# Altium schematic sheet Isolated-Inputs-Schematic.SchDoc
size A; SheetNumber: 3
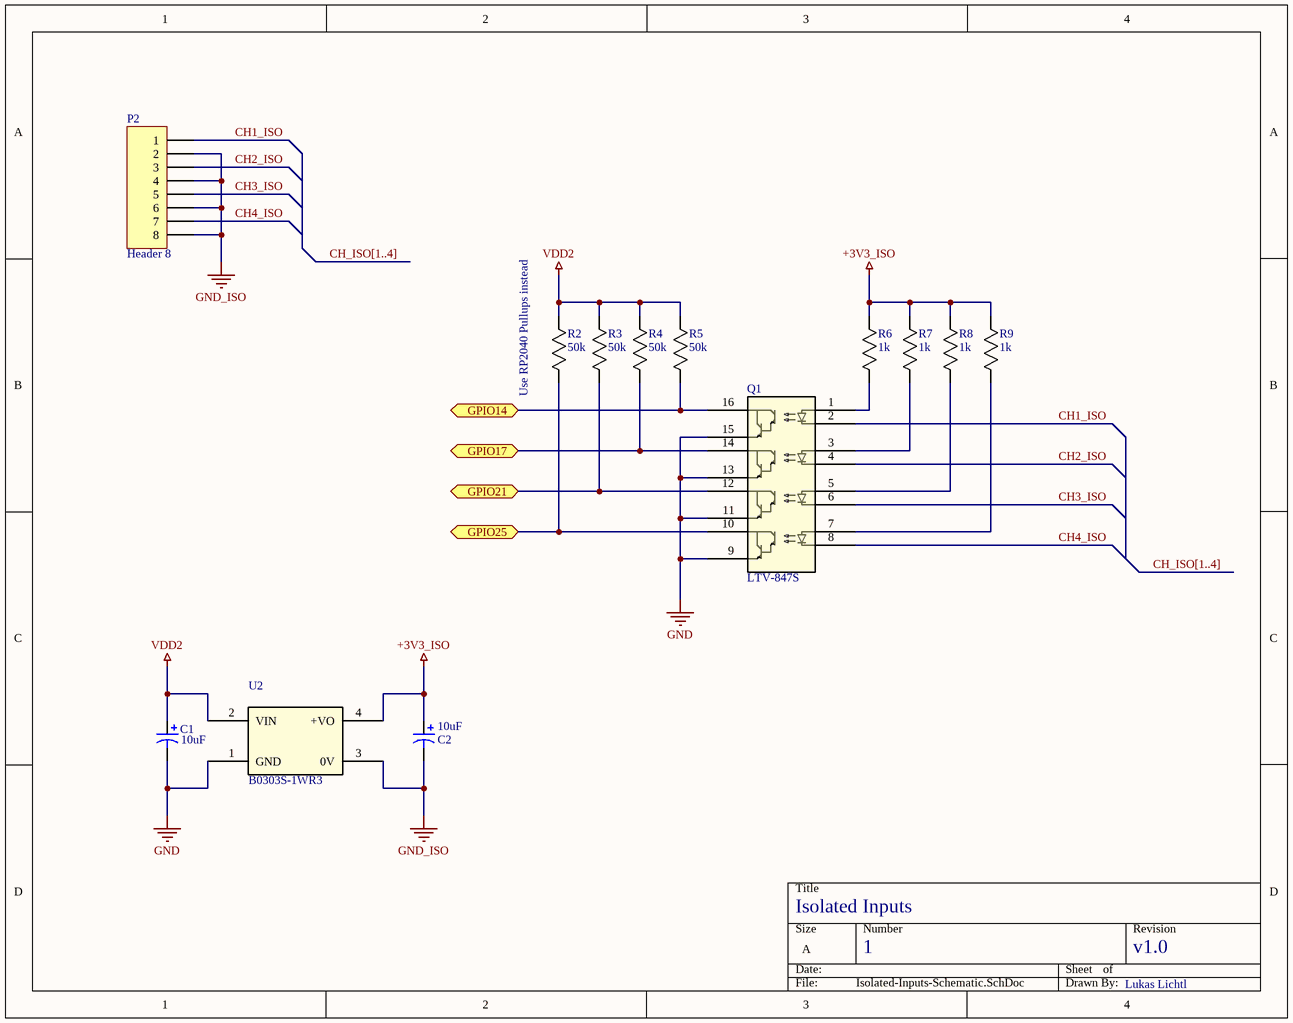
[diagram p0: Isolated-Inputs-Schematic.SchDoc]

## Parts
C1  value 10uF  [C0805]  (hidden comment: Cap Pol3)
C2  value 10uF  [C0805]  (hidden comment: Cap Pol3)
P2  Header 8  [HDR1X8]
Q1  LTV-847S  [LTV-847S_LTO]
R2  50k  [RC0603N_YAG]
R3  50k  [RC0603N_YAG]
R4  50k  [RC0603N_YAG]
R5  50k  [RC0603N_YAG]
R6  1k  [RC0603N_YAG]
R7  1k  [RC0603N_YAG]
R8  1k  [RC0603N_YAG]
R9  1k  [RC0603N_YAG]
U2  B0303S-1WR3  [SIP4_B_S-1WR3_MNS]

## Ports
GPIO14 (bidir), GPIO17 (bidir), GPIO21 (bidir), GPIO25 (bidir)

## Nets
+3V3_ISO: C2.1 R6.2 R7.2 R8.2 R9.2 U2.4(+VO)
GND: C1.2 Q1.9 Q1.11 Q1.13 Q1.15 U2.1(GND)
GND_ISO: C2.2 P2.2 P2.4 P2.6 P2.8 U2.3(0V)
VDD2: C1.1 R2.2 R3.2 R4.2 R5.2 U2.2(VIN)
CH1_ISO: P2.1 Q1.2
CH2_ISO: P2.3 Q1.4
CH3_ISO: P2.5 Q1.6
CH4_ISO: P2.7 Q1.8
GPIO14: Q1.16 R5.1 ; port GPIO14
GPIO17: Q1.14 R4.1 ; port GPIO17
GPIO21: Q1.12 R3.1 ; port GPIO21
GPIO25: Q1.10 R2.1 ; port GPIO25
NetQ1_1: Q1.1 R6.1
NetQ1_3: Q1.3 R7.1
NetQ1_5: Q1.5 R8.1
NetQ1_7: Q1.7 R9.1

## Buses and harness runs
bus CH_ISO[1..4]

## Notes on the sheet
- (near R2) Use RP2040 Pullups instead
- Isolated Inputs
- 1
- v1.0
- Lukas Lichtl

## Library data of the parts
C1 C2 = Cap Pol3: Polarized Capacitor (Surface Mount); Published: 8-Jun-2000; LatestRevisionDate: 29-May-2009; LatestRevisionNote: IPC-7351 Footprint Added.; PackageReference: C0805; Publisher: Altium Limited; PackageDescription: Chip Capacitor
P2 = Header 8: Header, 8-Pin; LatestRevisionDate: 17-Jul-2002; LatestRevisionNote: Re-released for DXP Platform.; Publisher: Altium Limited
Q1 = LTV-847S: No Description Available; Mfr_Name: LITE-ON; RefDes: RefDes; Type: Type
R2-R4 R6-R9 = RC0603FR-07470RL: No Description Available; Mfr_Name: Yageo
R5 = RC0603FR-07470RL: Mfr_Name: Yageo